# Altium schematic sheet Solar Panel Connectors.SchDoc: PV Headers
size Letter; SheetNumber: 14
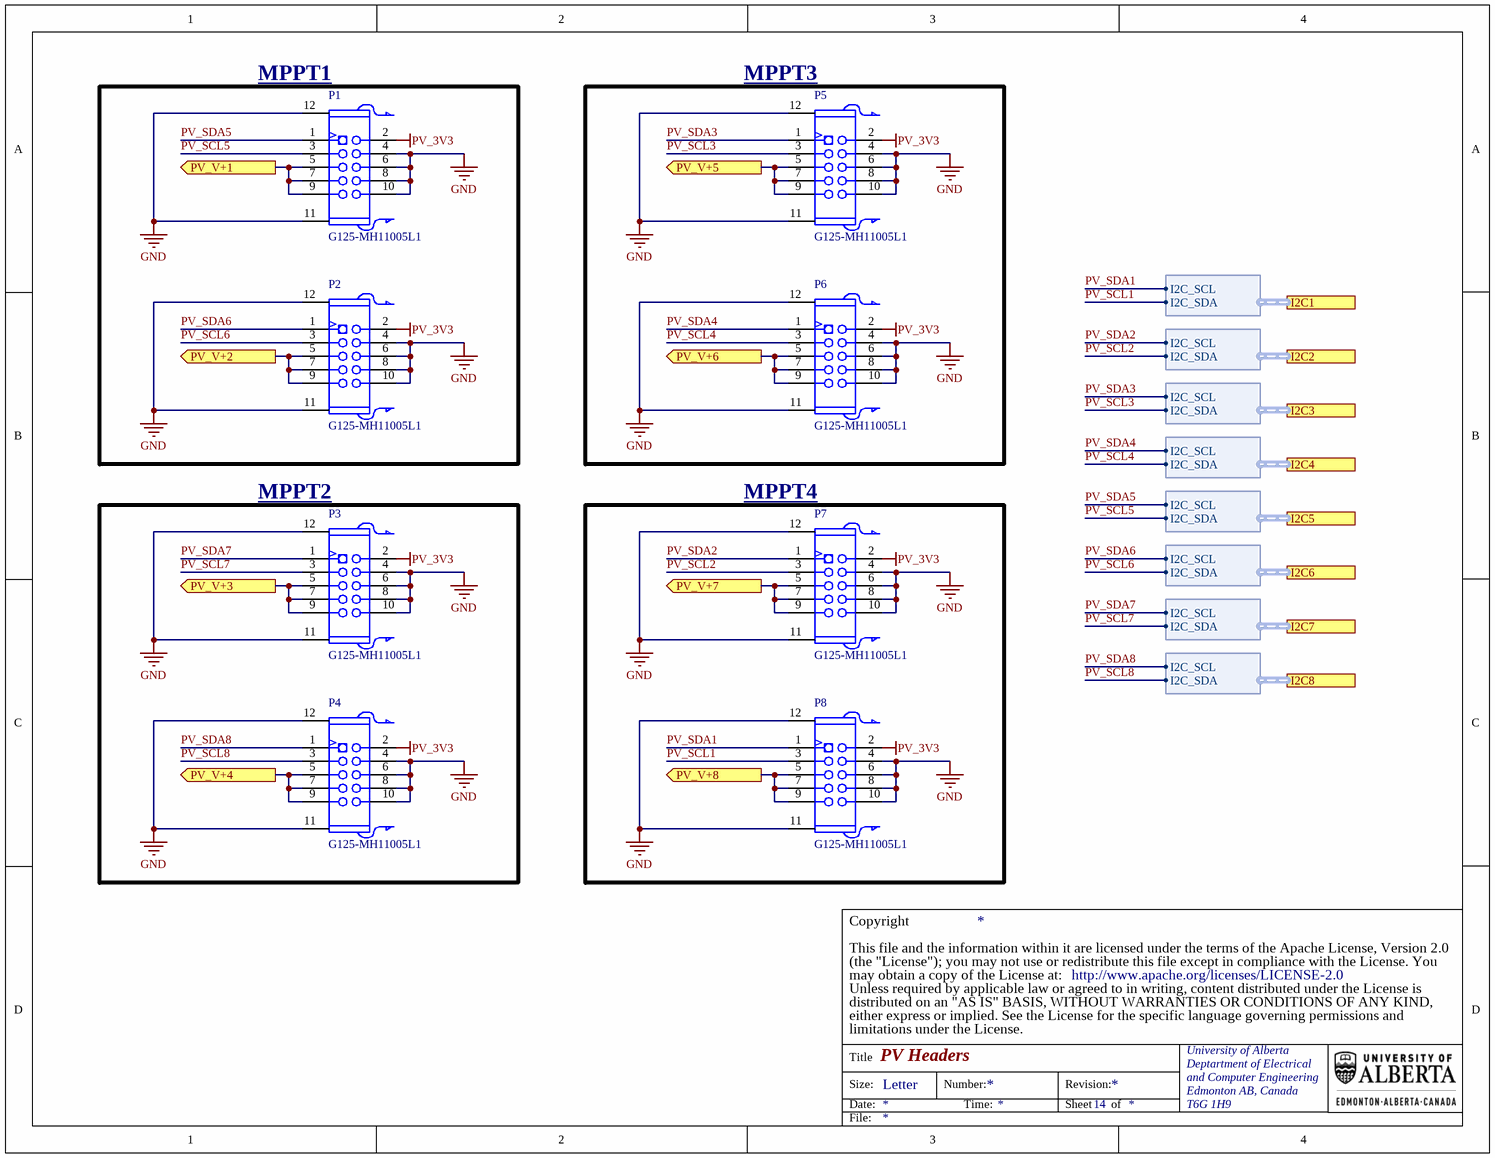
[diagram p0: Solar Panel Connectors.SchDoc]

## Parts
P1  G125-MH11005L1  [HWN-G125-MH11005L1]
P2  G125-MH11005L1  [HWN-G125-MH11005L1]
P3  G125-MH11005L1  [HWN-G125-MH11005L1]
P4  G125-MH11005L1  [HWN-G125-MH11005L1]
P5  G125-MH11005L1  [HWN-G125-MH11005L1]
P6  G125-MH11005L1  [HWN-G125-MH11005L1]
P7  G125-MH11005L1  [HWN-G125-MH11005L1]
P8  G125-MH11005L1  [HWN-G125-MH11005L1]

## Blocks framed on the sheet
MPPT1: P1 P2
MPPT3: P5 P6
MPPT2: P3 P4
MPPT4: P7 P8

## Ports
I2C1 (harness PV_I2C1), I2C2 (harness PV_I2C2), I2C3 (harness PV_I2C3), I2C4 (harness PV_I2C4), I2C5 (harness PV_I2C5), I2C6 (harness PV_I2C6), I2C7 (harness PV_I2C7), I2C8 (harness PV_I2C8), PV_V+1 (out), PV_V+2 (out), PV_V+3 (out), PV_V+4 (out), PV_V+5 (out), PV_V+6 (out), PV_V+7 (out), PV_V+8 (out)

## Harnesses
PV_I2C2: I2C_SCL, I2C_SDA
PV_I2C3: I2C_SCL, I2C_SDA
PV_I2C4: I2C_SCL, I2C_SDA
PV_I2C5: I2C_SCL, I2C_SDA
PV_I2C6: I2C_SCL, I2C_SDA
PV_I2C7: I2C_SCL, I2C_SDA
PV_I2C8: I2C_SCL, I2C_SDA
PV_I2C1: I2C_SCL, I2C_SDA

## Nets
GND: P1.4 P1.6 P1.8 P1.10 P1.11 P1.12 P2.4 P2.6 P2.8 P2.10 P2.11 P2.12 P3.4 P3.6 P3.8 P3.10 P3.11 P3.12 P4.4 P4.6 P4.8 P4.10 P4.11 P4.12 P5.4 P5.6 P5.8 P5.10 P5.11 P5.12 P6.4 P6.6 P6.8 P6.10 P6.11 P6.12 P7.4 P7.6 P7.8 P7.10 P7.11 P7.12 P8.4 P8.6 P8.8 P8.10 P8.11 P8.12
PV_3V3: P1.2 P2.2 P3.2 P4.2 P5.2 P6.2 P7.2 P8.2
PV_SCL1: P8.3 ; port I2C1.I2C_SDA
PV_SCL2: P7.3 ; port I2C2.I2C_SDA
PV_SCL3: P5.3 ; port I2C3.I2C_SDA
PV_SCL4: P6.3 ; port I2C4.I2C_SDA
PV_SCL5: P1.3 ; port I2C5.I2C_SDA
PV_SCL6: P2.3 ; port I2C6.I2C_SDA
PV_SCL7: P3.3 ; port I2C7.I2C_SDA
PV_SCL8: P4.3 ; port I2C8.I2C_SDA
PV_SDA1: P8.1 ; port I2C1.I2C_SCL
PV_SDA2: P7.1 ; port I2C2.I2C_SCL
PV_SDA3: P5.1 ; port I2C3.I2C_SCL
PV_SDA4: P6.1 ; port I2C4.I2C_SCL
PV_SDA5: P1.1 ; port I2C5.I2C_SCL
PV_SDA6: P2.1 ; port I2C6.I2C_SCL
PV_SDA7: P3.1 ; port I2C7.I2C_SCL
PV_SDA8: P4.1 ; port I2C8.I2C_SCL
PV_V+1: P1.5 P1.7 P1.9 ; port PV_V+1
PV_V+2: P2.5 P2.7 P2.9 ; port PV_V+2
PV_V+3: P3.5 P3.7 P3.9 ; port PV_V+3
PV_V+4: P4.5 P4.7 P4.9 ; port PV_V+4
PV_V+5: P5.5 P5.7 P5.9 ; port PV_V+5
PV_V+6: P6.5 P6.7 P6.9 ; port PV_V+6
PV_V+7: P7.5 P7.7 P7.9 ; port PV_V+7
PV_V+8: P8.5 P8.7 P8.9 ; port PV_V+8

## Notes on the sheet
- (the "License"); you may not use or redistribute this file except in compliance with the License. You
- This file and the information within it are licensed under the terms of the Apache License, Version 2.0
- Copyright
- Unless required by applicable law or agreed to in writing, content distributed under the License is
- distributed on an "AS IS" BASIS, WITHOUT WARRANTIES OR CONDITIONS OF ANY KIND,
- either express or implied. See the License for the specific language governing permissions and
- limitations under the License.
- may obtain a copy of the License at:
- http://www.apache.org/licenses/LICENSE-2.0
- Title
- Size:
- Date:
- Letter
- Number:
- Time:
- Revision:
- Sheet
- of
- University of Alberta
- Deptartment of Electrical
- and Computer Engineering
- Edmonton AB, Canada
- T6G 1H9
- File:

## Library data of the parts
P1-P8 = PP-HWN-00015: CONN HEADER R/A 10POS 1.25MM; Index: 15; Designator: P?; Part Number: PP-HWN-00015; Manufacturer Part Number: G125-MH11005L1P; Supplier Part Number 1: 952-2696-ND; Supplier 1: Digi-key; Supplier Part Number 2: 855-G125-MH11005L1P; Supplier 2: Mouser; Publisher: AlbertaSat; Published: 2019-07-08; LatestRevisionDate: 2023-05-04; LatestRevisionNote: Added operating temperature; Supplier Link: https://www.digikey.ca/products/en?keywords=952-2696-ND; Operating Temperature: -65°C ~ 150°C